# EAGLE design clock (EAGLE 6.6.0)
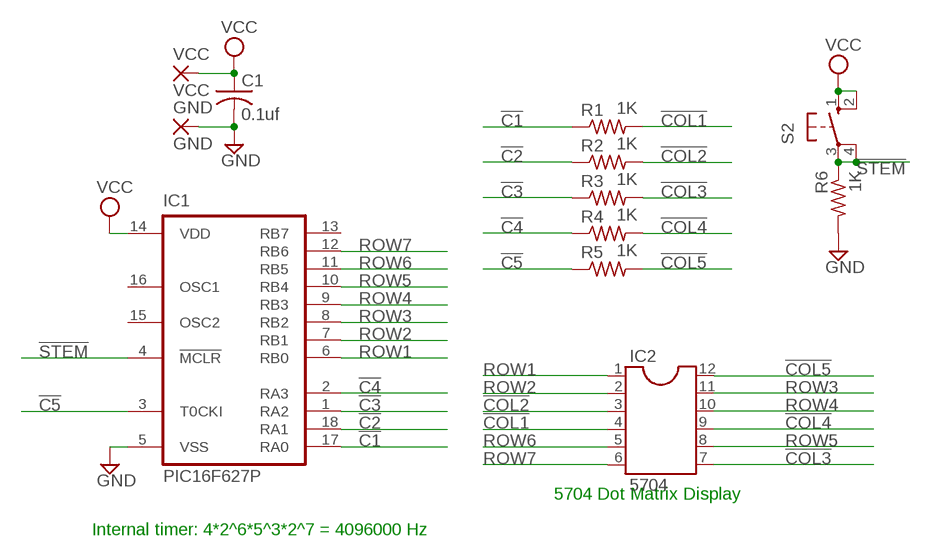
[diagram p0: schematic, sheet 1]

## Parts
C1  0.1uf  C-US025-025X050  [C025-025X050]
GND  GND  1,6/0,8  [1,6/0,8]
IC1  PIC16F627P  PIC16C622P  [DIL18]
IC2  5704  DIL12  [DIL12]
R1  1K  R-US_0207/10  [0207/10]
R2  1K  R-US_0207/10  [0207/10]
R3  1K  R-US_0207/10  [0207/10]
R4  1K  R-US_0207/10  [0207/10]
R5  1K  R-US_0207/10  [0207/10]
R6  1K  R-US_0207/10  [0207/10]
S2  10-XX  [B3F-10XX]
VCC  VCC  1,6/0,8  [1,6/0,8]

## Nets
!C1: IC1.17(RA0) R1.1
!C2: IC1.18(RA1) R2.1
!C3: IC1.1(RA2) R3.1
!C4: IC1.2(RA3) R4.1
!C5: IC1.3(T0CKI) R5.1
!COL1: IC2.4 R1.2
!COL2: IC2.3 R2.2
!COL3: IC2.7 R3.2
!COL4: IC2.9 R4.2
!COL5: IC2.12 R5.2
!STEM: IC1.4(!MCLR) R6.1 S2.3(P) S2.4(P1)
GND [Supply]: C1.2 GND.1(P) IC1.5(VSS) R6.2
ROW1: IC1.6(RB0) IC2.1
ROW2: IC1.7(RB1) IC2.2
ROW3: IC1.8(RB2) IC2.11
ROW4: IC1.9(RB3) IC2.10
ROW5: IC1.10(RB4) IC2.8
ROW6: IC1.11(RB5) IC2.5
ROW7: IC1.12(RB6) IC2.6
VCC [Supply]: C1.1 IC1.14(VDD) S2.1(S) S2.2(S1) VCC.1(P)
Unconnected: IC1.13(RB7) IC1.15(OSC2) IC1.16(OSC1)

## Notes on the sheet
- 5704 Dot Matrix Display
- Internal timer: 4*2^6*5^3*2^7 = 4096000 Hz

## Library data of the parts
C1 = rcl:C-US: CAPACITOR, American symbol
GND VCC = wirepad:1,6/0,8: THROUGH-HOLE PAD
IC1 = microchip:PIC16C*: MICROCONTROLLER PIC16C5X family: EPROM/ROM-based PIC16C55X family: EPROM-based PIC16C6X family PIC16CE62X family: analog comparators/EEPROM data memory PIC16C7X family: A/D converter PIC16C71X family: A/D converter PIC16F8X family: flash EEPROM Pin compatible devices: PIC16C154, PIC16CR154, PIC16C156, PIC16CR156, PIC16C158 PIC16CR158, PIC16C52, PIC16C54, PIC16C54A, PIC16CR54A PIC16C56, PIC16C58A, PIC16CR58A, PIC16C61, PIC16C554 PIC16C556, PIC16C558, PIC16C620, PIC16C621, PIC16C622 PIC16C641, PIC16C642, PIC16C661, PIC16C662, PIC16C71 PIC16C710, PIC16C711, PIC16C715, PIC126F83, PIC16CR83 PIC16F84A, PIC16CR84 see also PIC16F8* <DEVICE:PIC16F8*>; MF: MICROCHIP; MPN: PIC16C622A-04I/P; OC_FARNELL: 9759549; OC_NEWARK: 23C3984
IC2 = ic-package:DIL12: Dual In Line
R1-R6 = rcl:R-US_: RESISTOR, American symbol
S2 = switch-omron:10-XX: OMRON SWITCH; MPN: B3F-1000; OC_FARNELL: 176432; OC_NEWARK: 36M3542

## Net classes
1 Supply: width 0.406 mm

## Board
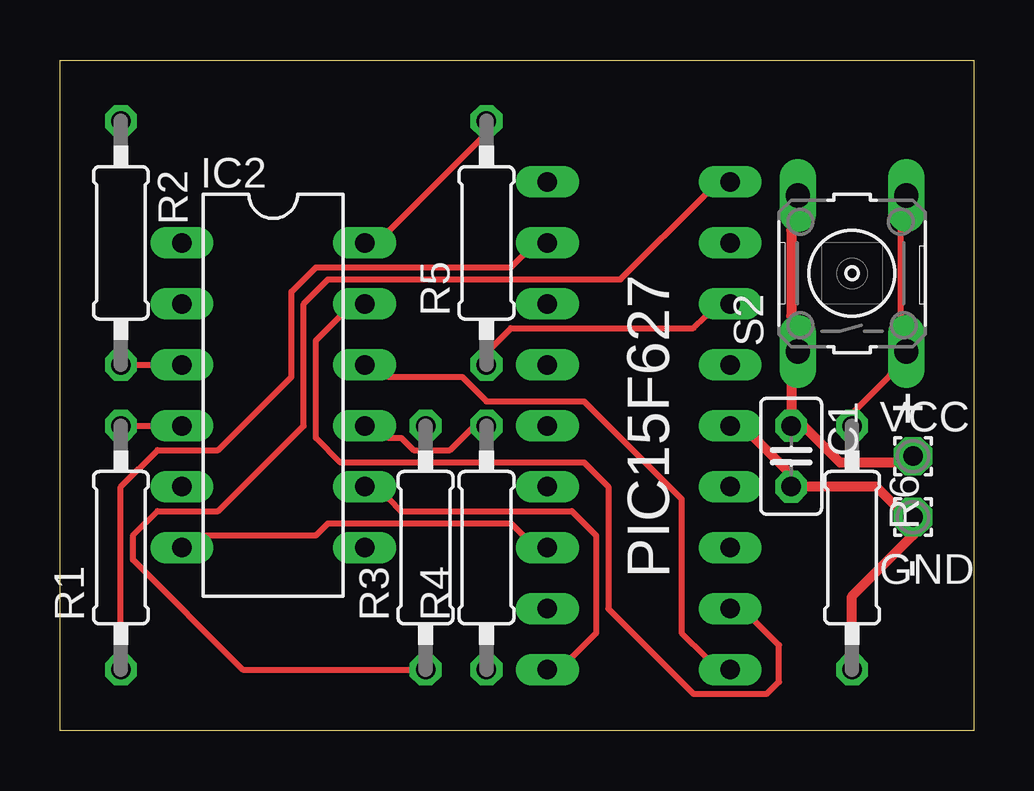
[diagram p1: board, top side]
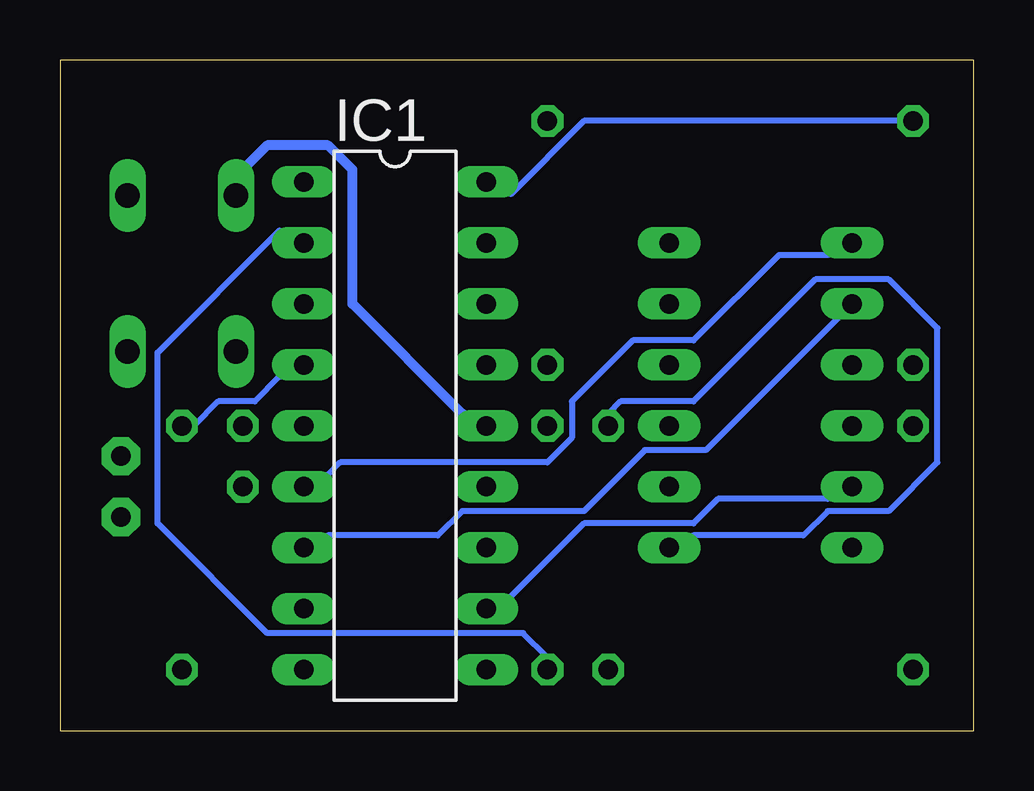
[diagram p2: board, bottom side, seen from below]

Size 38.1 x 27.94 mm. Coordinates in mm from the lower left corner, seen from the top.
Outline: 0,0 0,12.7 0,27.94 38.1,27.94 38.1,0 0,0
Copper layers (1*16): Top 0.035mm / dielectric 1.5mm / Bottom 0.035mm
Design rules "default": minimum track width 10mil, minimum drill 24mil, track to track 8mil, track to pad 8mil, pad to pad 8mil, via to via 8mil, smd to smd 8mil, copper to edge 40mil, drill to drill 8mil, minimum pad ring 10mil, minimum via ring 8mil, stop-mask expansion 4mil, vias tented up to drill 0mil, thermal gap 10mil

### Footprints (pad centres in the part's own frame; a part is rotated, then mirrored left to right if it is on the bottom)
C025-025X050 = drill 0.813 octagon: 1 -1.27,0; 2 1.27,0
1,6/0,8 = drill 0.813 pad 1.6 octagon: 1 0,0
DIL18 = drill 0.813 long: 1 -10.16,-3.81; 2 -7.62,-3.81; 3 -5.08,-3.81; 4 -2.54,-3.81; 5 0,-3.81; 6 2.54,-3.81; 7 5.08,-3.81; 8 7.62,-3.81; 9 10.16,-3.81; 10 10.16,3.81; 11 7.62,3.81; 12 5.08,3.81; 13 2.54,3.81; 14 0,3.81; 15 -2.54,3.81; 16 -5.08,3.81; 17 -7.62,3.81; 18 -10.16,3.81
DIL12 = drill 0.813 long: 1 -6.35,-3.81; 2 -3.81,-3.81; 3 -1.27,-3.81; 4 1.27,-3.81; 5 3.81,-3.81; 6 6.35,-3.81; 7 6.35,3.81; 8 3.81,3.81; 9 1.27,3.81; 10 -1.27,3.81; 11 -3.81,3.81; 12 -6.35,3.81
0207/10 = drill 0.813 octagon: 1 -5.08,0; 2 5.08,0
B3F-10XX = drill 1.016 long: 1 -3.251,2.261; 2 3.251,2.261; 3 -3.251,-2.261; 4 3.251,-2.261

### Placement (x,y rotation side)
C1  30.48,11.43 270 top
GND  35.56,8.89 0 top
IC1  24.13,12.7 270 bottom
IC2  8.89,13.97 270 top
R1  2.54,7.62 90 top
R2  2.54,20.32 270 top
R3  15.24,7.62 90 top
R4  17.78,7.62 90 top
R5  17.78,20.32 90 top
R6  33.02,7.62 270 top
S2  33.02,19.05 90 top
VCC  35.56,11.43 0 top

### Tracks (layer width: path | path; a pad name or v marks a point on that pad's centre or on a via)
!C1
  Top 0.254: R1.1 2.54,3.05 2.54,10.16 4.06,11.68 6.6,11.68 9.65,14.73 9.65,18.29 10.67,19.3 18.8,19.3 19.3,19.81 IC1.17
!C2
  Bottom 0.254: R2.1 3.05,25.4 16.26,25.4 19.3,22.35 IC1.18
!C3
  Top 0.254: R3.1 14.73,2.54 7.62,2.54 3.05,7.11 3.05,8.13 4.06,9.14 6.6,9.14 10.16,12.7 10.16,17.78 11.18,18.8 23.37,18.8 26.92,22.35 IC1.1
!C4
  Bottom 0.254: R4.1 17.78,3.05 18.8,4.06 29.46,4.06 34.04,8.64 34.04,15.75 28.96,20.83 IC1.2
!C5
  Top 0.254: R5.1 17.78,15.75 18.8,16.76 26.42,16.76 26.92,17.27 IC1.3
!COL1
  Top 0.254: R1.2 3.05,12.7 4.06,12.7 IC2.4
!COL2
  Top 0.254: R2.2 3.05,15.24 4.06,15.24 IC2.3
!COL3
  Bottom 0.254: IC2.7 11.68,8.13 7.11,8.13 6.1,9.14 3.56,9.14 1.52,11.18 1.52,16.76 3.56,18.8 6.6,18.8 11.68,13.72 14.73,13.72 15.24,13.21 R3.2
!COL4
  Top 0.254: IC2.9 13.72,12.19 14.22,12.19 14.73,11.68 16.26,11.68 17.27,12.7 R4.2
!COL5
  Top 0.254: IC2.12 13.72,20.83 17.78,24.89 R5.2
!STEM
  Top 0.254: R6.1 33.02,13.21 34.54,14.73 S2.3 35.05,17.27 35.05,20.83 S2.4
  Bottom 0.254: IC1.4 28.96,14.73 29.97,13.72 31.5,13.72 32.51,12.7 R6.1
GND
  Top 0.406: IC1.5 28.96,12.19 30.48,10.67 C1.2 30.99,10.16 34.04,10.16 35.05,9.14 GND.1 35.56,8.13 33.02,5.59 33.02,3.05 R6.2
ROW1
  Bottom 0.254: IC2.1 6.1,19.81 8.13,19.81 11.68,16.26 14.22,16.26 16.76,13.72 16.76,12.19 17.78,11.18 26.42,11.18 26.92,10.67 IC1.6
ROW2
  Bottom 0.254: IC1.7 26.92,8.13 22.35,8.13 21.34,9.14 16.26,9.14 13.72,11.68 11.18,11.68 5.59,17.27 IC2.2
ROW3
  Top 0.254: IC1.8 28.96,4.57 29.97,3.56 29.97,2.03 29.46,1.52 26.42,1.52 22.86,5.08 22.86,10.16 21.84,11.18 11.68,11.18 10.67,12.19 10.67,16.26 11.68,17.27 IC2.11
ROW4
  Top 0.254: IC2.10 13.72,14.73 16.76,14.73 17.78,13.72 21.84,13.72 25.91,9.65 25.91,4.06 26.92,3.05 IC1.9
ROW5
  Top 0.254: IC1.10 21.34,3.05 22.35,4.06 22.35,8.13 21.34,9.14 14.22,9.14 13.72,9.65 IC2.8
ROW6
  Bottom 0.254: IC2.5 6.1,9.65 10.67,9.65 11.68,8.64 16.26,8.64 19.3,5.59 IC1.11
ROW7
  Top 0.254: IC2.6 6.1,8.13 10.67,8.13 11.18,8.64 18.8,8.64 19.3,8.13 IC1.12
VCC
  Top 0.406: VCC.1 35.05,11.18 32.51,11.18 30.99,12.7 C1.1 30.48,13.21 30.48,14.73 S2.1 30.48,17.27 30.48,20.83 S2.2
  Bottom 0.406: IC1.14 21.34,13.21 25.91,17.78 25.91,23.37 26.92,24.38 29.46,24.38 30.48,23.37 S2.2

### Text on the board
tPlace: + | PIC15F627 | -